# Altium schematic sheet Power Supply.SchDoc
size A4; SheetNumber: 2; SheetTotal: 4
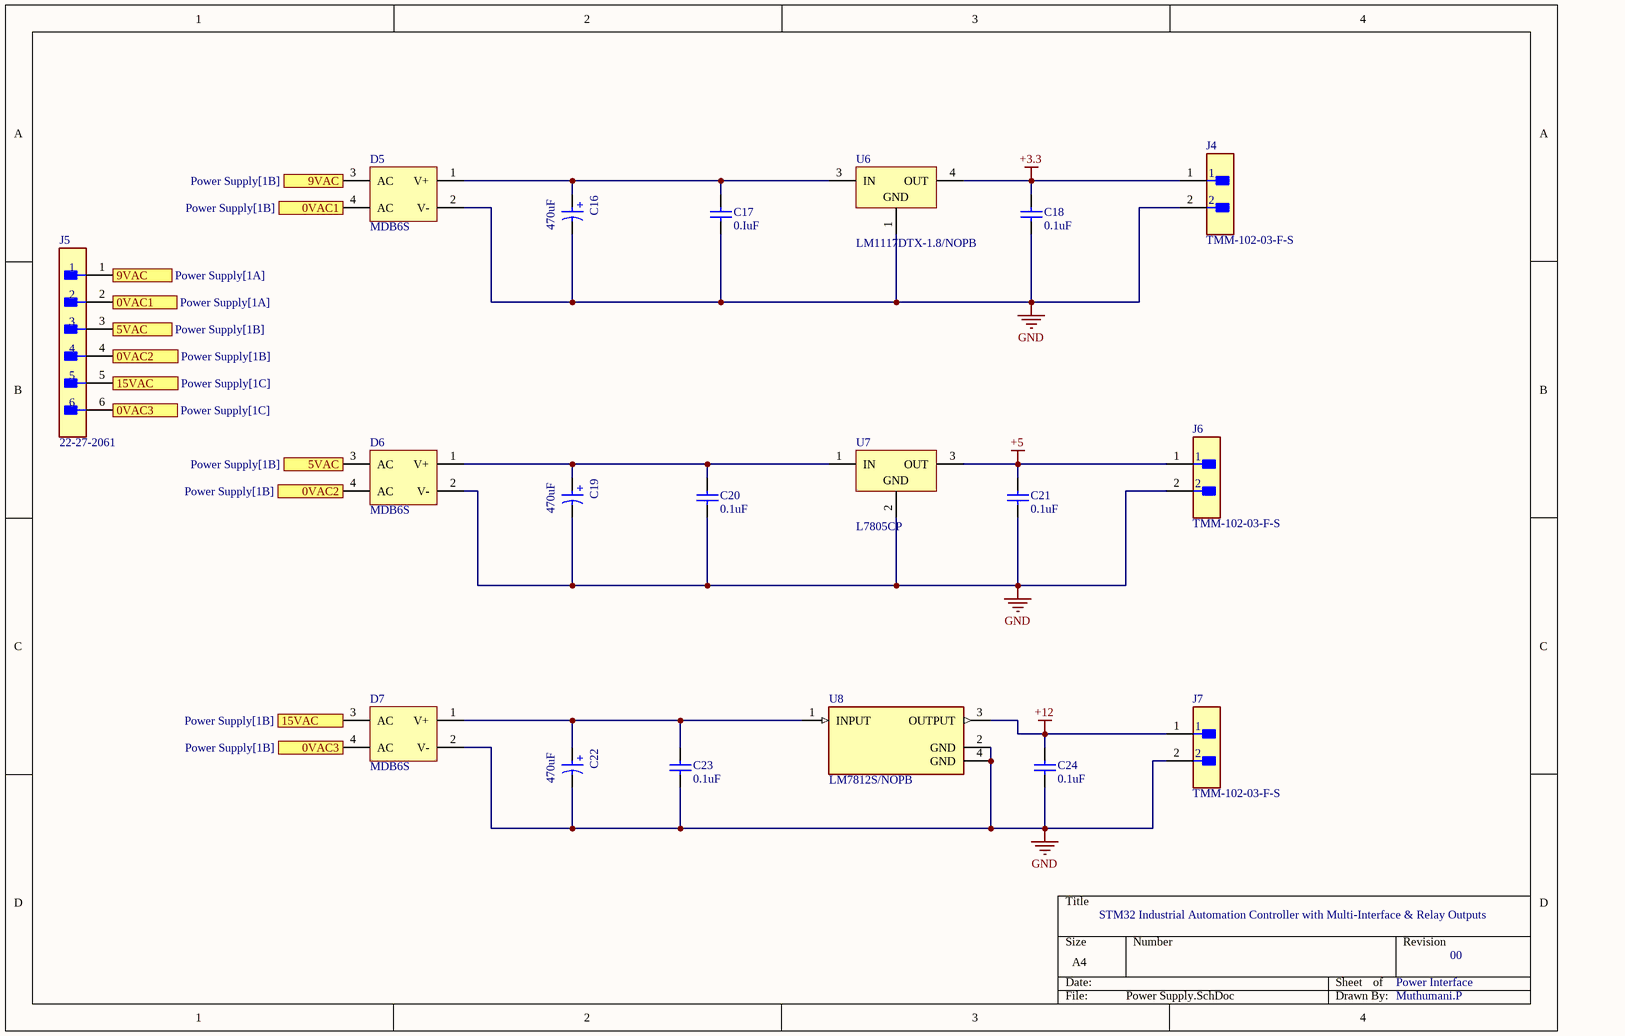
[diagram p0: Power Supply.SchDoc]

## Parts
C16  470uF  [WCAP-ATLI_D13H25]
C17  0.IuF  [CAPC2013X145X50NL20T25]
C18  0.1uF  [CAPC2013X145X50NL20T25]
C19  470uF  [WCAP-ATLI_D13H25]
C20  0.1uF  [CAPC2013X145X50NL20T25]
C21  0.1uF  [CAPC2013X145X50NL20T25]
C22  470uF  [WCAP-ATLI_D13H25]
C23  0.1uF  [CAPC2013X145X50NL20T25]
C24  0.1uF  [CAPC2013X145X50NL20T25]
D5  MDB6S  [FAIR-MDBXS-4_V]
D6  MDB6S  [FAIR-MDBXS-4_V]
D7  MDB6S  [FAIR-MDBXS-4_V]
J4  TMM-102-03-F-S  [FP-TMM-102-03-F-S-MFG]
J5  22-27-2061  [FP-22-27-2061-MFG]
J6  TMM-102-03-F-S  [FP-TMM-102-03-F-S-MFG]
J7  TMM-102-03-F-S  [FP-TMM-102-03-F-S-MFG]
U6  LM1117DTX-1.8/NOPB  [NDP0003B_N]
U7  L7805CP  [TO220FP]
U8  LM7812S/NOPB  [FP-KTT0003B-MFG]

## Ports
0VAC1 (in, see Power Supply[1B]), 0VAC1 (out, see Power Supply[1A]), 0VAC2 (in, see Power Supply[1B]), 0VAC2 (out, see Power Supply[1B]), 0VAC3 (in, see Power Supply[1B]), 0VAC3 (out, see Power Supply[1C]), 5VAC (in, see Power Supply[1B]), 5VAC (out, see Power Supply[1B]), 9VAC (in, see Power Supply[1B]), 9VAC (out, see Power Supply[1A]), 15VAC (in, see Power Supply[1B]), 15VAC (out, see Power Supply[1C])

## Nets
+3.3: C18.2 J4.1 U6.4(OUT)
+5: C21.2 J6.1 U7.3(OUT)
+12: C24.2 J7.1 U8.3(OUTPUT)
GND: C16.2(N) C17.1 C18.1 C19.2(N) C20.1 C21.1 C22.2(N) C23.1 C24.1 D5.2(V-) D6.2(V-) D7.2(V-) J4.2 J6.2 J7.2 U6.1(GND) U7.2(GND) U8.2(GND) U8.4(GND)
0VAC1: D5.4(AC) J5.2 ; port 0VAC1
0VAC2: D6.4(AC) J5.4 ; port 0VAC2
0VAC3: D7.4(AC) J5.6 ; port 0VAC3
5VAC: D6.3(AC) J5.3 ; port 5VAC
9VAC: D5.3(AC) J5.1 ; port 9VAC
15VAC: D7.3(AC) J5.5 ; port 15VAC
NetC16_1: C16.1(P) C17.2 D5.1(V+) U6.3(IN)
NetC19_1: C19.1(P) C20.2 D6.1(V+) U7.1(IN)
NetC22_1: C22.1(P) C23.2 D7.1(V+) U8.1(INPUT)

## Notes on the sheet
- STM32 Industrial Automation Controller with Multi-Interface & Relay Outputs
- Power Interface
- 00
- Muthumani.P
- (in symbol CMP-03913-54218056-2) +

## Library data of the parts
C16 C19 C22 = CMP-03913-54218056-2: Cap, 2700Uf, 16V, Alu Elec, Radial Rohs Compliant: Yes; Life (Hours): 5000hours; Pitch: 5mm; Capacitance: 2.7mF; Leakage Current: 432µA; Tolerance: 20%; Polarity: Polar; Impedance: 22mΩ; Ripple Current: 3A; Mount: Through Hole; Voltage Rating: 16V; Max Operating Temperature: 105°C; Min Operating Temperature: -55°C; Case/Package: Radial; Length: 25mm; Diameter: 13mm; Height - Seated (Max): 26.4922mm; Packaging: Tape & Box (TB); Lead Pitch: 5.0038mm; RoHS: Compliant
C17 C18 C20 C21 C23 C24 = CMP-2007-01227-1: Manufacturer: Kemet; Part Number: C0805S104K5RACTU
D5-D7 = CMP-0950-00003-1: 600 V, 1 A, Single-Phase Bridge Rectifier, -55 to 150 degC, 4-Pin 5 x 4.4 x 1.6 mm MicroDIP, RoHS, Tape and Reel; Manufacturer: Fairchild Semiconductor; IR: 10 uA; VF: 1.1 V; IF (AV): 1 A; VRRM: 600 V; CJ: 10 pF; IFSM: 30 A; ComponentLink1URL: http://www.fairchildsemi.com/; PackageDescription: 4-Pin Micro Surface Mount, Body 5 x 4.4 mm, Height 1.6 mm; ComponentLink1Description: Manufacturer URL; DatasheetVersion: Rev. 1.2.1; PackageReference: MDBXS-4; ComponentLink2Description: Datasheet; ComponentLink2URL: http://www.fairchildsemi.com/ds/MD/MDB10S.pdf; Temp. Range: -55 to 150 degC; Mounting Technology: Surface Mount; PartNumber: MDB6S; Packing: Tape and Reel; RoHS: TRUE
J4 J6 J7 = CMP-02766-001614-1: CONN HEADER VERT 2POS 2MM; Number of Contacts: 2; Gender: Male; Pitch: 2mm; Packaging: Bulk; RoHS Compliant: Yes; Termination: Solder; Contact Plating: Gold; Mount: Through Hole; Number of Rows: 1; Radiation Hardening: No; Lead Free: Lead Free
J5 = CMP-04776-000309-1: CONN HEADER VERT 6POS 2.54MM; Number of Contacts: 6; Current Rating: 4A; Voltage Rating (AC): 250V; Contact Resistance: 10mR; Hole Diameter: 1.02mm; Connector Type: Male Pin; Gender: Male; Mount: Through Hole; REACH SVHC: No SVHC; Number of Rows: 1; Contact Plating: Tin; Series: KK; Depth: 5.8mm; Flammability Rating: UL94 V-0; Contact Type: Male Pin; Lead Pitch: 2.54mm; Min Operating Temperature: 0°C; Pitch: 2.54mm; Radiation Hardening: No; Color: Natural; Length: 15.24mm; Termination: Solder; Orientation: Straight; Contact Material: Brass; Max Voltage Rating (AC): 250V; Housing Material: Nylon; Max Operating Temperature: 75°C; Working Voltage: 250V; Max Current Rating: 4A; Fastening Type: Friction; Voltage Rating: 250V; Housing Color: White; Packaging: Bulk; Material: Nylon; Contact Mating Length: 0.295inch; Package Quantity: 10000; Number of Positions: 6
U6 = CMP-0062-00684-3: 800mA Low-Dropout Linear Regulator, 3-pin TO-252, Pb-Free; Manufacturer: Texas Instruments; PowerWise: N; CompType: LDO IC; PackageTopMarking: NSUZXYTT*LM1117*DT-1.8; ComponentLink1URL: http://www.ti.com/general/docs/lit/getliterature.tsp?genericPartNumber=LM1117-N&fileType=pdf; PackageDescription: TO252, Molded, Jedec, 6.8 x 6.10 x 2.30mm Body, 3 Lead, 2.28mm Pitch, Surface Mount; PinCount: 3; PackageReference: NDP0003B; ComponentLink1Description: Datasheet URL; Code_JEDEC: TO-252-AA; RoHS: Y
U7 = CMP-0244-00474-1: Positive Voltage Regulator, 5V, 3-Pin TO-220FP; ComponentLink1Description: Manufacturer URL; ComponentLink2Description: Datasheet; DatasheetVersion: 16/11/2011; PackageDescription: TO, Thru-Hole, Vertical, Heatsink Mounted; 3 In-Line Leads; Pitch 2.54 mm; ComponentLink2URL: http://www.st.com/internet/com/TECHNICAL_RESOURCES/TECHNICAL_LITERATURE/DATASHEET/CD00000444.pdf; ComponentLink1URL: http://www.st.com; PackageVersion: 2011; PackageReference: TO220FP
U8 = CMP-04917-000197-1: IC REG LINEAR 12V 1.5A; Quiescent Current: 8mA; Dropout Voltage: 2V; Lead Free: Contains Lead; RoHS Compliant: Yes; Min Operating Temperature: 0°C; Case/Package: TO-263; Max Operating Temperature: 125°C